# EAGLE board teensyMotors02_up_LED (EAGLE 9.1.3)
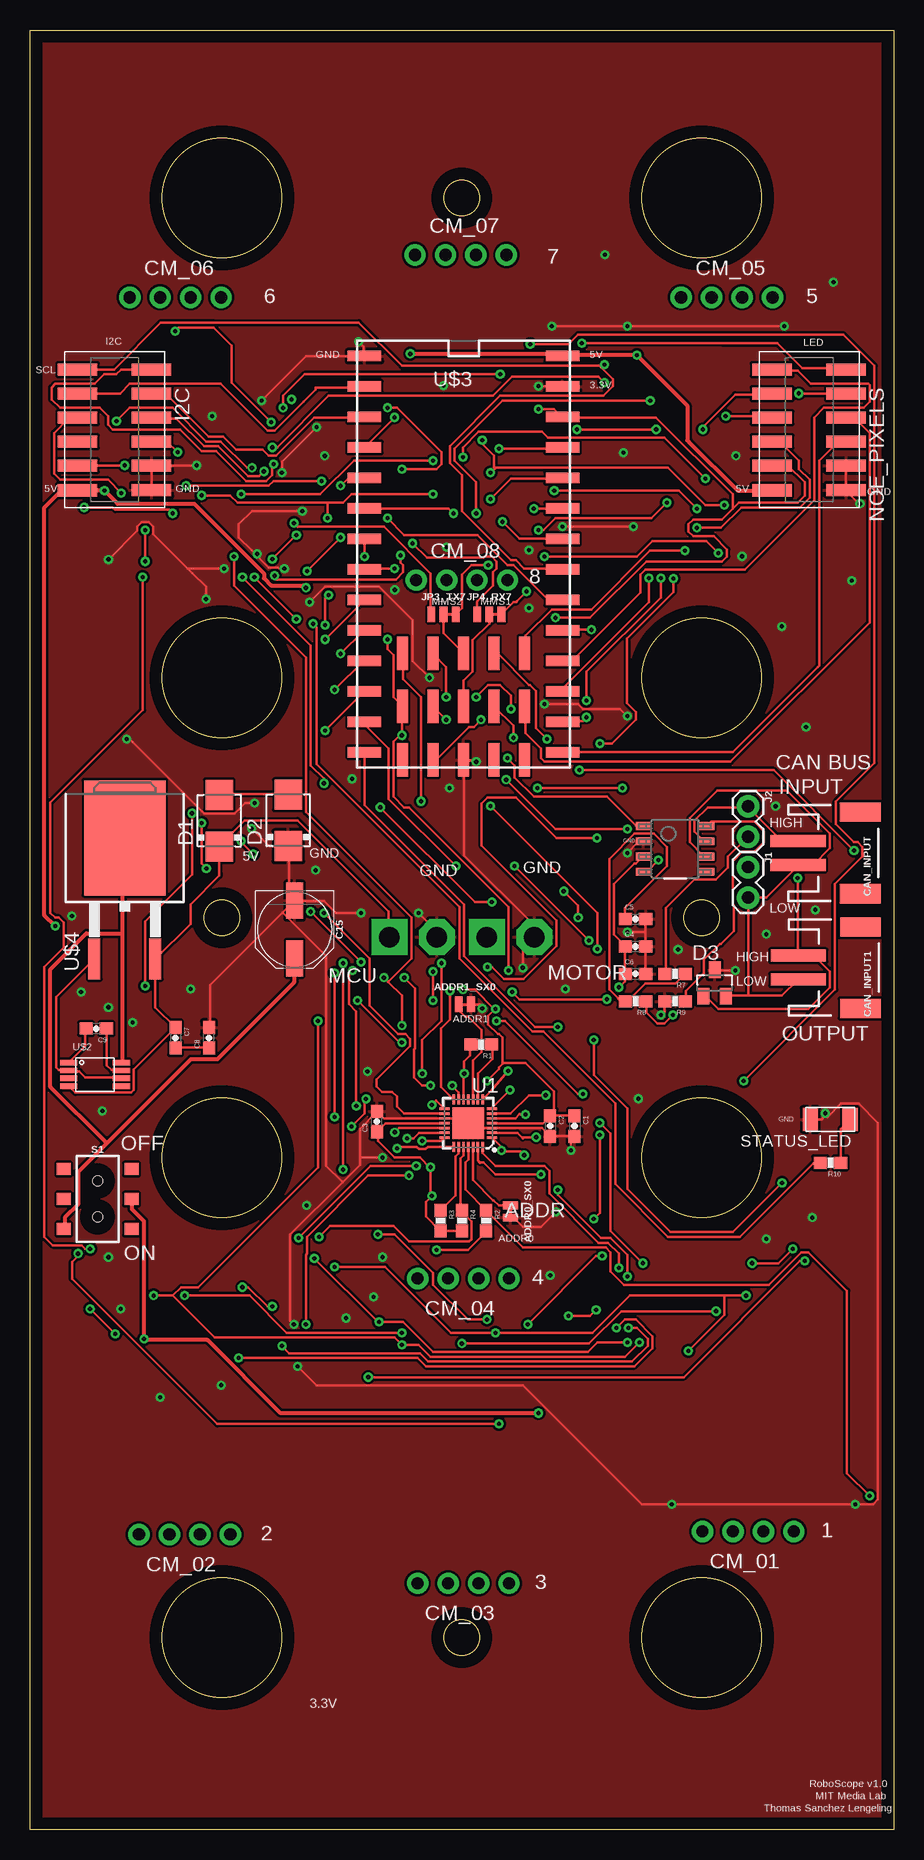
[diagram p2: board, top side]
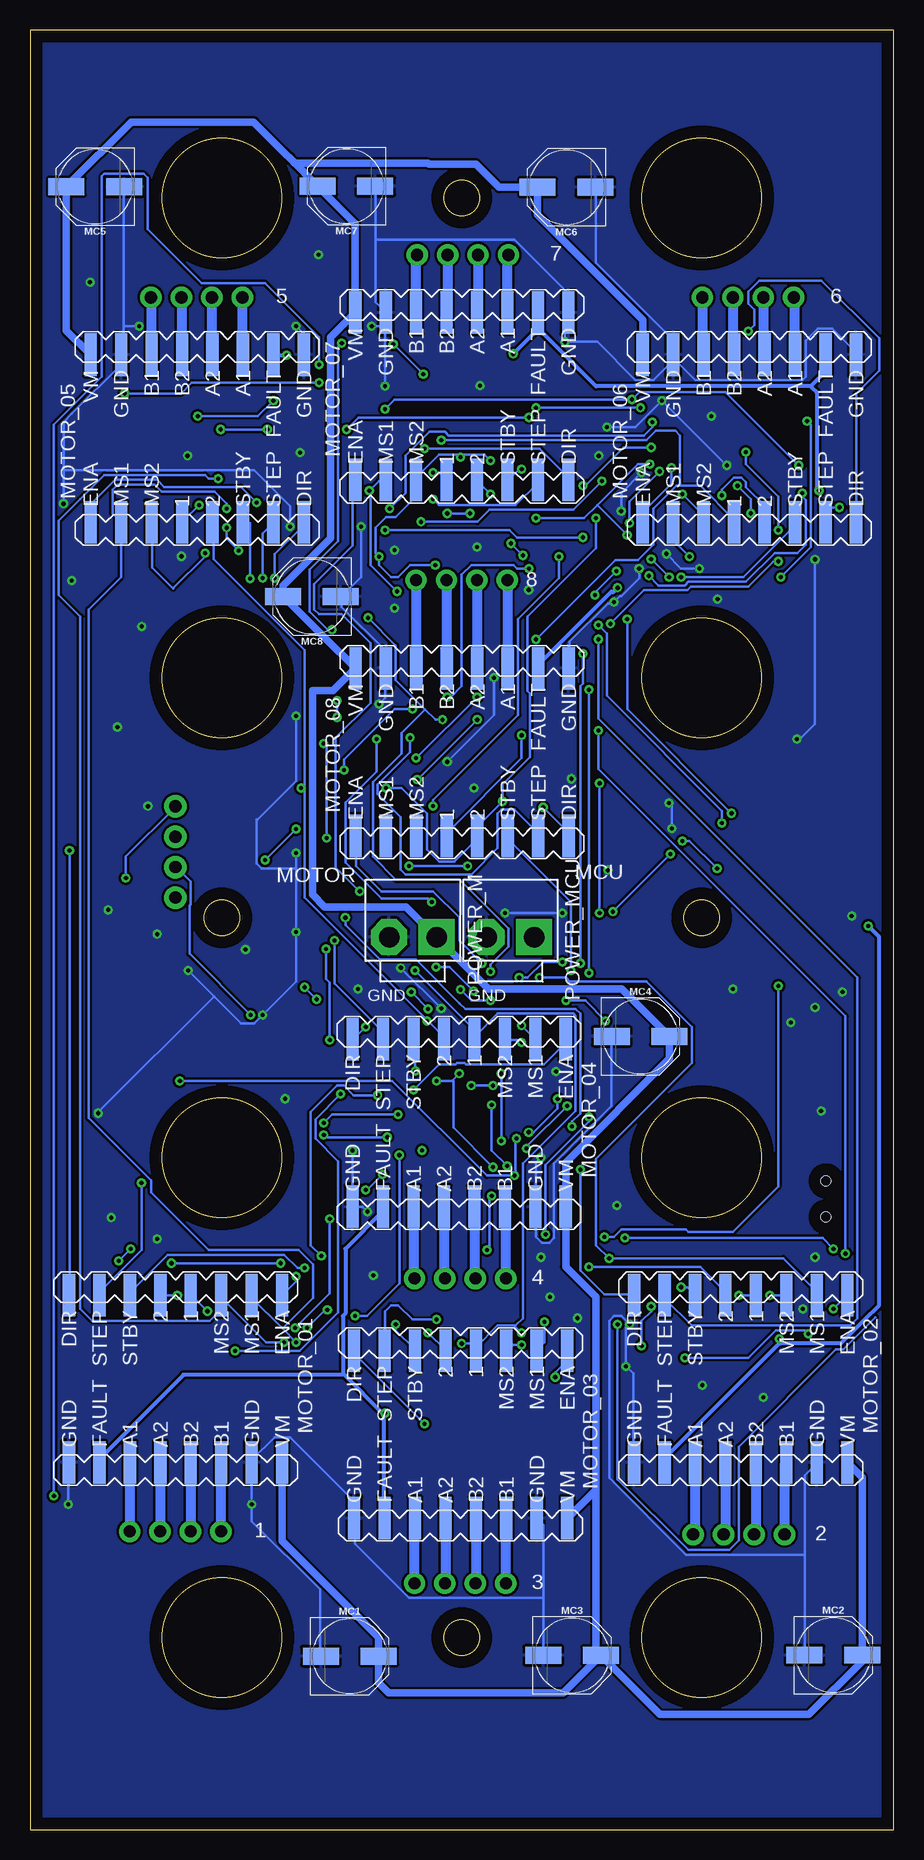
[diagram p3: board, bottom side, seen from below]

Size 72 x 150 mm. Coordinates in mm from the lower left corner, seen from the top.
Outline: 72,150 72,0 0,0 0,150 72,150
Outline: circle at 56,136 radius 5
Outline: circle at 56,96 radius 5
Outline: circle at 56,56 radius 5
Outline: circle at 56,16 radius 5
Outline: circle at 16,16 radius 5
Outline: circle at 16,56 radius 5
Outline: circle at 16,96 radius 5
Outline: circle at 16,136 radius 5
Outline: circle at 36,136 radius 1.5
Outline: circle at 16,76 radius 1.5
Outline: circle at 36,16 radius 1.5
Outline: circle at 56,76 radius 1.5
Copper layers (1*16): Top 0.035mm / dielectric 1.5mm / Bottom 0.035mm
Design rules "default *": minimum track width 6mil, minimum drill 0.35mm, track to track 6mil, track to pad 6mil, pad to pad 6mil, via to via 6mil, smd to smd 6mil, copper to edge 40mil, drill to drill 6mil, minimum pad ring 10mil, minimum via ring 8mil, stop-mask expansion 4mil, vias tented up to drill 0mil, thermal gap 10mil
Net classes: 0 default: width 0.2 mm, clearance 0.2 mm; 1 gnd: width 0.2 mm, clearance 0.2 mm; 3 vcc: width 0.2 mm, clearance 0.2 mm; 4 vcc5: width 0.35 mm, clearance 0.2 mm

## Footprints (pad centres in the part's own frame; a part is rotated, then mirrored left to right if it is on the bottom)
SMT-JUMPER_2_NC_TRACE_NO-SILK = smd 0.635 x 1.27: 1 -0.508,0; 2 0.508,0
0603-CAP = smd 1.1 x 1: 1 -0.85,0; 2 0.85,0
PANASONIC_D = smd 3 x 1.4: + 2.4,0; - -2.4,0
JST-2-SMD = smd 1 x 4.6: 1 -1,-3.7; 2 1,-3.7 | smd 1.6 x 3.4: NC1 -3.4,1.5; NC2 3.4,1.5
1X04-CLEANBIG = drill 1.016 pad 1.778: 1 -3.81,0; 2 -1.27,0; 3 1.27,0; 4 3.81,0
DO214AA = smd 2.5 x 2.3: A 2.15,0; C -2.15,0
SOT23 = smd 1 x 1.4: 1 -0.95,-1.1; 2 0.95,-1.1; 3 0,1.1
TMMH-105-12 = smd 1.016 x 3.302: 1 -5.27,-3.086; 2 -5.27,3.086; 3 -3.27,-3.086; 4 -3.27,3.086; 5 -1.27,-3.086; 6 -1.27,3.086; 7 0.73,-3.086; 8 0.73,3.086; 9 2.73,-3.086; 10 2.73,3.086; 11 4.781,-3.099; 12 4.755,3.086
1X02 = drill 1.016 pad 1.88: 1 0,0; 2 2.54,0
SMT-JUMPER_3_1-NC_TRACE_NO-SILK = smd 0.635 x 1.27: 1 -1.016,0; 2 0,0; 3 1.016,0
DRV8880 = smd 3.556 x 1.016: 1 -6.985,1.27; 2 -6.985,-1.27; A1 6.985,-3.81; A2 6.985,-1.27; B1 6.985,3.81; B2 6.985,1.27; DIR -6.985,-8.89; ENA -6.985,8.89; FAULT 6.985,-6.35; GND_0 6.985,-8.89; GND_1 6.985,6.35; MS1 -6.985,6.35; MS2 -6.985,3.81; STBY -6.985,-3.81; STEP -6.985,-6.35; VM 6.985,8.89
B2P-VH = drill 1.7 pad 3 square: 1 -1.98,0 | drill 1.7 pad 3 octagon: 2 1.98,0
0603-RES = smd 1.1 x 1: 1 -0.85,0; 2 0.85,0
SWITCH_DPDT_SMD_AYZ0202 = smd 1 x 1.15: 1 -2.5,2.825; 2 0,2.825; 3 2.5,2.825; 4 -2.5,-2.825; 5 0,-2.825; 6 2.5,-2.825 | hole 0.85: 1.5,0; -1.5,0
LED1206FAB = smd 1.27 x 1.905: 1 -1.651,0; 2 1.651,0
QFN-28 = smd 0.85 x 0.2: 1 -1.975,1.2; 2 -1.975,0.8; 3 -1.975,0.4; 4 -1.975,0; 5 -1.975,-0.4; 6 -1.975,-0.8; 7 -1.975,-1.2; 15 1.975,-1.2; 16 1.975,-0.8; 17 1.975,-0.4; 18 1.975,0; 19 1.975,0.4; 20 1.975,0.8; 21 1.975,1.2 | smd 0.2 x 0.85: 8 -1.2,-1.975; 9 -0.8,-1.975; 10 -0.4,-1.975; 11 0,-1.975; 12 0.4,-1.975; 13 0.8,-1.975; 14 1.2,-1.975; 22 1.2,1.975; 23 0.8,1.975; 24 0.4,1.975; 25 0,1.975; 26 -0.4,1.975; 27 -0.8,1.975; 28 -1.2,1.975 | smd 2.65 x 2.65: 29 0,0
SN65HVD232Q = smd 1.27 x 0.635: CANH 2.625,0.635; CANL 2.625,-0.635; D -2.625,1.905; GND -2.625,0.635; R -2.625,-1.905; RS 2.625,1.905; VCC -2.625,-0.635; VREF 2.625,-1.905
VSSOP(8) = smd 1.435 x 0.445: ANODE -2.2,-1.05; CATHODE 2.2,0.9; GDRIVE 2.2,-0.4; GPD -2.2,0.25; NC@1 -2.2,-0.4; NC@2 2.2,-1.05; VCAPH 2.2,0.25; VCAPL -2.2,0.9
TEENSY_4.0_SMD = smd 2.794 x 0.889: 0 -8.255,13.97; 1 -8.255,11.43; 2 -8.255,8.89; 3 -8.255,6.35; 3.3V 8.255,11.43; 4 -8.255,3.81; 5 -8.255,1.27; 6 -8.255,-1.27; 7 -8.255,-3.81; 8 -8.255,-6.35; 9 -8.255,-8.89; 10 -8.255,-11.43; 11 -8.255,-13.97; 12 -8.255,-16.51; 13 8.255,-16.51; 14/A0 8.255,-13.97; 15/A1 8.255,-11.43; 16/A2 8.255,-8.89; 17/A3 8.255,-6.35; 18/A4 8.255,-3.81; 19/A5 8.255,-1.27; 20/A6 8.255,1.27; 21/A7 8.255,3.81; 22/A8 8.255,6.35; 23/A9 8.255,8.89; GND -8.255,16.51; GND2 8.255,13.97; VIN 8.255,16.51 | smd 0.889 x 2.794: 3.3V1 -2.54,-17.145; 24 5.08,-12.7; 25 5.08,-8.255; 26 2.54,-12.7; 27 2.54,-8.255; 28 0,-12.7; 29 0,-8.255; 30 -2.54,-12.7; 31 -2.54,-8.255; 32 -5.08,-12.7; 33 -5.08,-8.255; GND1 0,-17.145; PGM 2.54,-17.145; RESET 5.08,-17.145; VBAT -5.08,-17.145
TO263-3 = smd 1 x 3.4: 1 -2.54,-9.14; 3 2.54,-9.14 | smd 6.8 x 9.6: 4 0,0.96
SX1509 = smd 2.184 x 1.067: 0 -7.62,7.62; 1 -7.62,5.08; 2 -7.62,2.54; 3 -7.62,0; 4 -7.62,-5.08; 5 -7.62,-7.62; 6 -7.62,-10.16; 7 -7.62,-12.7; 8 7.62,-12.7; 9 7.62,-10.16; 10 7.62,-7.62; 11 7.62,-5.08; 12 7.62,0; 13 7.62,2.54; 14 7.62,5.08; 15 7.62,7.62; GND_1 7.62,10.16; GND_2 -7.62,10.16; VC2 7.62,-2.54; VCC1 -7.62,-2.54 | smd 1.067 x 2.184: 3.3V 1.27,-17.78; 3.3V_1 1.27,15.24; GND -1.27,-17.78; GND_3 -1.27,15.24; INT -6.35,15.24; OSC -6.35,-17.78; RST -3.81,-17.78; RST_1 -3.81,15.24; SCL 6.35,-17.78; SCL_2 6.35,15.24; SDA 3.81,-17.78; SDA_2 3.81,15.24

## Placement (x,y rotation side)
ADDR0_SX0  JUMPER-SMT_2_NC_TRACE_NO-SILK  [SMT-JUMPER_2_NC_TRACE_NO-SILK]  40.07,51.52 270 top
ADDR1_SX0  JUMPER-SMT_2_NC_TRACE_NO-SILK  [SMT-JUMPER_2_NC_TRACE_NO-SILK]  36.26,68.79 0 top
C1  0.1uF  [0603-CAP]  45.4,58.63 270 top
C2  0.1uF  [0603-CAP]  43.37,58.63 270 top
C3  0.1uF  [0603-CAP]  28.93,59.01 90 top
C4  2.2uf  [0603-CAP]  50.48,73.61 0 top
C5  4.7uf  [0603-CAP]  50.48,75.9 0 top
C6  0.1uf  [0603-CAP]  50.48,71.33 0 top
C7  0.1uf  [0603-CAP]  12.13,65.99 270 top
C8  0.1uf  [0603-CAP]  14.92,65.99 90 top
C9  2.2uf  [0603-CAP]  5.53,66.76 180 top
C15  100uF  [PANASONIC_D]  22.07,75.02 270 top
CAN_INPUT  [JST-2-SMD]  67.73,81.4 270 top
CAN_INPUT1  [JST-2-SMD]  67.76,71.84 270 top
CM_01  1X04_STRAIGHT  [1X04-CLEANBIG]  59.88,24.85 180 top
CM_02  1X04_STRAIGHT  [1X04-CLEANBIG]  12.89,24.59 180 top
CM_03  1X04_STRAIGHT  [1X04-CLEANBIG]  36.13,20.53 180 top
CM_04  1X04_STRAIGHT  [1X04-CLEANBIG]  36.13,45.93 180 top
CM_05  1X04_STRAIGHT  [1X04-CLEANBIG]  58.1,127.72 0 top
CM_06  1X04_STRAIGHT  [1X04-CLEANBIG]  12.13,127.72 0 top
CM_07  1X04_STRAIGHT  [1X04-CLEANBIG]  35.91,131.24 0 top
CM_08  1X04_STRAIGHT  [1X04-CLEANBIG]  36.01,104.15 0 top
D1  S2M  [DO214AA]  15.78,84.09 90 top
D2  S2M  [DO214AA]  21.54,84.11 90 top
D3  PESD1CAN  [SOT23]  57.09,70.57 0 top
I2C  TMMH-105-12  [TMMH-105-12]  7.05,116.41 270 top
J1  [1X02]  59.88,80.22 270 top
J2  [1X02]  59.88,85.3 270 top
JP3_TX7  JUMPER-SMT_3_1-NC_TRACE_NO-SILK  [SMT-JUMPER_3_1-NC_TRACE_NO-SILK]  34.48,101.3 0 top
JP4_RX7  JUMPER-SMT_3_1-NC_TRACE_NO-SILK  [SMT-JUMPER_3_1-NC_TRACE_NO-SILK]  38.29,101.3 0 top
MC1  100uF  [PANASONIC_D]  45.34,14.45 0 bottom
MC2  100uF  [PANASONIC_D]  5.02,14.54 0 bottom
MC3  100uF  [PANASONIC_D]  26.8,14.51 0 bottom
MC4  100uF  [PANASONIC_D]  21.1,66.1 0 bottom
MC5  100uF  [PANASONIC_D]  66.56,136.94 180 bottom
MC6  100uF  [PANASONIC_D]  27.27,136.89 180 bottom
MC7  100uF  [PANASONIC_D]  45.61,136.98 180 bottom
MC8  100uF  [PANASONIC_D]  48.48,102.77 180 bottom
MOTOR_01  DRV8880  [DRV8880]  59.86,37.57 270 bottom
MOTOR_02  DRV8880  [DRV8880]  12.74,37.57 270 bottom
MOTOR_03  DRV8880  [DRV8880]  36.09,32.94 270 bottom
MOTOR_04  DRV8880  [DRV8880]  36.22,58.89 270 bottom
MOTOR_05  DRV8880  [DRV8880]  58.05,115.95 90 bottom
MOTOR_06  DRV8880  [DRV8880]  12.02,115.95 90 bottom
MOTOR_07  DRV8880  [DRV8880]  35.99,119.47 90 bottom
MOTOR_08  DRV8880  [DRV8880]  35.98,89.82 90 bottom
NOE_PIXELS  TMMH-105-12  [TMMH-105-12]  64.96,116.41 270 top
POWER_M  B2P-VH  [B2P-VH]  40.07,74.38 180 bottom
POWER_MCU  B2P-VH  [B2P-VH]  31.94,74.38 180 bottom
R1  10K  [0603-RES]  37.64,65.42 180 top
R2  10K  [0603-RES]  38.04,50.75 270 top
R3  10K  [0603-RES]  34.23,50.75 270 top
R4  10K  [0603-RES]  36.01,50.75 270 top
R7  60  [0603-RES]  53.79,71.33 180 top
R8  60  [0603-RES]  50.48,69.04 180 top
R9  10K  [0603-RES]  53.79,69.04 180 top
R10  500  [0603-RES]  66.74,55.58 180 top
S1  [SWITCH_DPDT_SMD_AYZ0202]  5.64,52.56 270 top
STATUS_LED  LEDFAB1206  [LED1206FAB]  66.72,59.19 180 top
U1  SX1509  [QFN-28]  36.55,58.87 180 top
U$1  SN65HVD232Q  [SN65HVD232Q]  53.79,81.74 0 top
U$2  [VSSOP(8)]  5.43,63.02 0 top
U$3  TEENSY_4.0_WITH_SMD_HEADER_PINSTEENSY_4.0_SMD  [TEENSY_4.0_SMD]  36.15,106.31 0 top
U$4  [TO263-3]  7.91,81.69 0 top
U$5  SX1509  [SX1509]  -18.86,12.15 0 top  (outside the outline)

## Tracks (layer width: path | path; a pad name or v marks a point on that pad's centre or on a via)
0_SX0  (via drill 0.35)
  Top 0.2: U1.27 37.35,55.76 37.53,55.58 37.61,55.61 37.81,55.61 38.81,54.61 v42.61,54.61 | v44.01,53.31 44.01,52.91 47.61,49.31 48.41,49.31 49.81,47.91 v49.81,46.11
  Bottom 0.2: v42.61,54.61 43.91,53.31 v44.01,53.31 | v49.81,46.11 49.81,45.71 50.91,44.61 MOTOR_01.ENA
1_SX0  (via drill 0.35)
  Top 0.2: U1.28 37.75,56.38 38.8,55.33 38.81,55.31 42.91,55.31 43.31,54.91 43.31,53.01 47.41,48.91 48.21,48.91 49.11,48.01 v49.11,46.81
  Bottom 0.2: v49.11,46.81 49.71,46.81 50.81,47.91 60.51,47.91 63.61,44.81 63.61,44.61 MOTOR_01.STBY
2_SX0  (via drill 0.35)
  Top 0.2: U1.1 39.31,56.89 v39.31,56.6 39.41,56.51 40.91,56.51 v41.21,56.21 | v44.91,42.81 46.71,42.81 v47.21,43.31 | v48.91,41.81 49.61,42.51 50.51,42.51 51.91,41.11 51.91,40.11 50.41,38.61 33.01,38.61 32.31,39.31 v17.41,39.31 | v5.01,43.41 v7.11,41.31
  Bottom 0.2: v41.21,56.21 41.21,45.51 43.91,42.81 v44.91,42.81 | v47.21,43.31 47.41,43.31 v48.91,41.81 | v17.41,39.31 12.11,39.31 9.81,41.61 7.41,41.61 v7.11,41.31 | v5.01,43.41 3.91,44.51 MOTOR_02.ENA
3.3V  (via drill 0.35)
  Top 0.2: R4.2 34.31,49.91 R3.2 34.21,49.91 33.01,51.11 33.01,52.31 v33.51,52.81 33.41,52.81 33.41,55.11 33.36,55.16 | v33.91,48.31 36.51,48.31 38.01,49.81 R2.2 | 33.36,55.16 32.51,56.01 30.41,56.01 29.01,57.41 29.01,58.11 C3.1 29.63,58.87 U1.18 | U$1.VCC 51.11,81.11 50.51,80.51 50.41,80.51 48.71,78.81 48.71,74.61 49.61,73.71 C4.1 49.61,73.61 49.61,71.41 C6.1 49.61,71.31 49.61,70.71 v49.11,70.21 | 43.71,59.51 45.31,59.51 C1.1 | 43.71,59.51 43.41,59.51 C2.1 | v38.11,62.41 39.11,63.41 39.11,63.51 39.46,63.86 | 39.46,63.86 39.51,63.91 41.31,63.91 43.71,61.51 43.71,59.51 | R1.2 36.71,65.41 36.71,64.51 36.21,64.01 v36.21,63.01 36.15,62.95 U1.12 | 43.71,59.51 C2.1 | v48.11,69.21 40.81,69.21 v40.21,69.81 | 39.46,63.86 39.41,63.91 39.41,66.01 39.11,66.31 39.01,66.31 38.21,67.11 38.21,67.81 v38.81,68.41 38.71,68.41 37.11,70.01 v36.11,70.01 | v33.41,55.21 33.36,55.16 | v37.61,92.51 37.01,91.91 36.61,91.91 33.91,89.21 33.61,89.21 U$3.3.3V1 | v43.81,101.01 46.71,101.01 51.41,105.71 57.71,105.71 58.11,106.11 58.11,106.71 57.01,107.81 55.31,107.81 54.91,108.21 54.91,108.81 55.31,109.21 57.71,109.21 58.61,110.11 | 58.61,110.11 58.61,111.31 52.21,117.71 44.41,117.71 U$3.3.3V 44.31,117.81 43.71,118.41 v42.41,118.41 | v33.61,71.51 v33.61,69.11 | U1.4 42.76,58.87 C2.1 | v7.91,113.71 4.01,113.71 I2C.9 | 58.61,110.11 59.11,110.61 64.01,110.61 64.61,111.21 64.61,112.31 63.21,113.71 61.91,113.71 NOE_PIXELS.9
  Bottom 0.2: v33.91,48.31 33.71,48.51 33.71,52.61 v33.51,52.81 | 36.76,62.46 36.81,62.41 v38.11,62.41 | 36.76,62.46 v36.21,63.01 | v48.11,69.21 v49.11,70.21 | v38.81,68.41 v40.21,69.81 | v33.41,55.21 36.71,58.51 36.71,62.41 36.76,62.46 | v37.61,92.51 38.21,92.51 39.06,93.36 | 39.06,93.36 41.51,95.81 41.51,98.71 v43.81,101.01 | v42.41,118.41 41.61,119.21 v21.81,119.21 21.21,119.81 14.01,119.81 v7.91,113.71 | v36.11,70.01 35.21,69.11 v33.61,69.11 | v33.61,71.51 33.61,72.11 32.11,73.61 32.11,75.11 36.21,79.21 41.51,79.21 43.41,81.11 43.41,87.31 41.01,89.71 41.01,91.41 39.11,93.31 39.06,93.36
3_SX0  (via drill 0.35)
  Top 0.2: U1.2 40.63,58.07 41.05,57.65 | 41.05,57.65 41.09,57.61 | v42.21,57.71 41.11,57.71 41.05,57.65 | v47.51,57.91 47.51,51.41 v47.01,50.91 | v49.91,41.81 50.61,41.81 51.51,40.91 51.51,40.31 50.21,39.01 33.21,39.01 32.51,39.71 21.61,39.71 v21.01,40.31 | v20.21,43.61 19.81,43.61 18.21,45.21 v17.71,45.21
  Bottom 0.2: v42.21,57.71 47.31,57.71 v47.51,57.91 | v47.01,50.91 47.01,44.71 v49.91,41.81 | v21.01,40.31 21.01,42.41 20.21,43.21 v20.21,43.61 | v17.71,45.21 17.21,45.21 16.61,44.61 MOTOR_02.STBY
4_SX0  (via drill 0.35)
  Top 0.2: U1.5 40.46,59.27 40.83,59.64 40.91,59.61 v41.31,59.61 | v47.51,58.91 48.41,58.01 48.41,49.91 v51.11,47.21 | v60.21,47.21 62.41,47.21 v63.61,48.41 | v64.61,47.41 64.21,47.41 54.51,37.71 v28.21,37.71
  Bottom 0.2: v41.31,59.61 46.81,59.61 v47.51,58.91 | v60.21,47.21 v51.11,47.21 | v64.61,47.41 v63.61,48.41 | v28.21,37.71 28.21,38.11 27.21,39.11 27.21,39.91 MOTOR_03.ENA
5_SX0  (via drill 0.35)
  Top 0.2: U1.6 40.07,59.67 41.59,61.17 41.61,61.21 v43.01,61.21 | v47.71,47.81 47.21,47.81 v41.51,42.11
  Bottom 0.2: v43.01,61.21 45.01,61.21 45.81,62.01 46.41,62.01 48.61,59.81 48.61,48.71 v47.71,47.81 | v41.51,42.11 41.51,41.61 39.91,40.01 MOTOR_03.STBY
6_SX0  (via drill 0.35)
  Top 0.2: v40.03,61.66 38.53,60.16 U1.7
  Bottom 0.2: v40.03,61.66 37.91,63.78 36.53,63.78 36.41,63.91 35.78,63.91 35.66,63.78 29.16,63.78 27.41,65.53 27.41,65.78 MOTOR_04.ENA
7_SX0  (via drill 0.35)
  Top 0.2: v39.87,63.22 38.42,61.56 U1.8
  Bottom 0.2: v39.87,63.22 39.91,63.28 39.91,65.78 MOTOR_04.STBY
8_SX0  (via drill 0.35)
  Top 0.2: U1.13 35.75,61.42 35.24,61.93 v35.21,62.01 | v33.41,62.01 32.71,62.01 32.01,62.71 32.01,65.01 32.11,65.11 32.11,70.11 v31.21,71.01 | v23.41,76.51 v27.61,72.31 | v18.61,81.31 17.61,82.31 v17.61,82.41 | v14.71,80.11 14.31,80.51 v14.31,83.91 | v24.61,100.41 24.61,102.61 v24.91,102.91 | v25.91,107.71 v23.11,104.91 | v42.41,108.31 42.81,108.31 43.81,109.31 51.81,109.31 v53.11,110.61
  Bottom 0.2: v33.41,62.01 v35.21,62.01 | v31.21,71.01 30.51,71.01 29.21,72.31 v27.61,72.31 | v18.61,81.31 v23.41,76.51 | v17.61,82.41 17.01,82.41 v14.71,80.11 | v24.61,100.41 23.91,99.71 23.91,94.51 14.31,84.91 v14.31,83.91 | v24.91,102.91 24.91,103.11 v23.11,104.91 | v25.91,107.71 31.41,107.71 32.01,108.31 v42.41,108.31 | v53.11,110.61 54.41,111.91 60.81,111.91 61.41,112.51 64.91,112.51 66.91,110.51 66.91,109.01 MOTOR_05.ENA
9_SX0  (via drill 0.35)
  Top 0.2: v35.03,69.91 35.03,67.53 34.28,66.78 34.28,61.91 35.28,60.91 U1.14 | v38.16,71.91 38.53,71.91 39.53,70.91 41.16,70.91 43.91,73.66 43.91,75.78 37.66,82.03 37.66,85.53 38.16,86.03 40.53,86.03 43.91,82.66 v47.28,82.66 | v47.53,90.53 48.53,90.53 50.53,92.53 50.53,93.16 49.78,93.91 49.78,99.28 53.66,103.16 v53.66,104.28
  Bottom 0.2: v35.03,69.91 37.03,71.91 v38.16,71.91 | v47.28,82.66 47.28,90.53 v47.53,90.53 | v53.66,104.28 53.66,108.91 54.16,108.91 MOTOR_05.STBY
10_SX0  (via drill 0.35)
  Top 0.2: U1.15 33.87,60.77 33.81,60.71 v33.51,60.41 | v32.21,55.31 28.41,55.31 v22.41,49.31 | v5.01,48.41 4.61,48.41 4.31,48.71 1.91,48.71 1.21,49.41 1.21,71.91 2.81,73.51 2.81,75.61 2.41,76.01 2.11,76.01 1.71,76.41 1.71,85.61 9.41,93.31 v9.41,104.41 | v18.51,113.51 18.11,113.51 15.91,115.71 14.71,115.71 11.91,118.51 8.31,118.51 v7.21,117.41
  Bottom 0.2: v33.51,60.41 33.51,56.61 v32.21,55.31 | v22.41,49.31 5.91,49.31 v5.01,48.41 | v18.51,113.51 18.51,112.21 20.91,109.81 20.91,109.01 MOTOR_06.ENA | v7.21,117.41 6.91,117.11 6.91,106.91 v9.41,104.41
11_SX0  (via drill 0.35)
  Top 0.2: U1.16 31.18,59.67 30.58,60.27 30.58,61.09 30.19,61.48 29.37,61.48 28.89,61.96 28.89,62.18 28.91,62.21 28.91,62.51 31.71,65.31 31.71,65.91 31.31,66.31 30.71,66.31 28.31,68.71 28.31,72.61 v24.51,76.41 | v24.51,87.21 24.51,87.61 23.41,88.71 23.41,98.71 v17.71,104.41
  Bottom 0.2: v24.51,87.21 v24.51,76.41 | v17.71,104.41 12.51,104.41 8.31,108.61 8.31,108.91 MOTOR_06.STBY
12_SX0  (via drill 0.35)
  Top 0.2: U1.19 30.77,58.47 v30.42,58.12 | v26.81,58.61 27.91,59.71 27.91,60.81 v28.01,60.91 | v45.71,76.01 45.71,77.01 v44.51,78.21
  Bottom 0.2: v26.81,58.61 26.81,59.01 26.11,59.71 26.11,68.01 26.51,68.41 35.71,68.41 36.17,68.87 39.81,72.51 42.81,72.51 45.71,75.41 v45.71,76.01 | v44.51,78.21 46.51,80.21 46.51,91.01 43.61,93.91 43.61,98.91 46.01,101.31 47.91,101.31 48.31,101.71 48.31,103.81 45.11,107.01 45.11,112.21 44.91,112.41 MOTOR_07.ENA | v28.01,60.91 28.01,60.11 30.01,58.11 v30.41,58.11 v30.42,58.12
13_SX0  (via drill 0.35)
  Top 0.2: v31.43,57.61 31.97,57.61 32.42,58.07 U1.20 | v31.61,54.51 28.21,54.51 23.11,49.41 23.11,48.01 23.01,47.91 v23.01,42.11 | v29.81,118.51 30.61,118.51 34.31,114.81 34.31,113.81 33.91,113.41 v31.01,113.41 | v21.11,118.51 21.11,119.51 22.91,121.31 v39.21,121.31 | v41.71,123.81 44.91,123.81 45.71,124.61 67.81,124.61 70.41,122.01 70.41,88.91 67.21,85.71 67.21,83.81 68.71,82.31 69.01,82.31 69.41,81.91 69.41,81.11 67.11,78.81 67.11,70.01 v59.51,62.41
  Bottom 0.2: v23.01,42.11 23.01,29.21 17.11,23.31 13.71,23.31 12.91,24.11 12.91,31.91 4.81,40.01 4.21,40.01 1.51,42.71 | v31.01,113.41 31.21,113.41 32.11,112.51 MOTOR_07.STBY | v31.43,57.61 31.51,57.61 31.51,54.61 v31.61,54.51 33.91,54.51 41.81,62.41 v59.51,62.41 | v21.11,118.51 v29.81,118.51 | v41.71,123.81 v39.21,121.31
14_SX0  (via drill 0.35)
  Top 0.2: U1.21 34.3,57.39 v32.7,57.39 | v32.71,63.01 32.71,65.81 34.31,67.41 v34.31,72.21
  Bottom 0.2: v32.71,63.01 v32.71,57.41 v32.7,57.39 | v34.31,72.21 36.21,74.11 36.21,76.01 38.41,78.21 42.71,78.21 44.81,80.31 44.81,82.81 MOTOR_08.ENA
15_SX0  (via drill 0.35)
  Top 0.2: v30.6,56.77 30.72,56.89 32.24,56.89 32.42,56.71 32.99,56.71 33.17,56.89 U1.22 | v27.21,60.31 27.21,68.21 26.61,68.81 26.61,71.31 v26.91,71.61
  Bottom 0.2: v27.21,60.31 30.51,57.01 30.51,56.81 v30.6,56.77 | v26.91,71.61 26.91,77.31 32.11,82.51 32.11,82.81 MOTOR_08.STBY
28_MMS1
  Top 0.2: JP4_RX7.2 38.29,100.54 36.89,99.14 36.89,96.54 36.15,95.79 U$3.28
29_MMS2
  Top 0.2: JP3_TX7.2 34.48,99.72 U$3.29
!INT_SX0
  Top 0.2: U1.9 37.35,63.02 38.55,64.22 38.55,65.36 R1.1
!RESET_SX0
  Top 0.2: U1.23 35.75,56.35 35.5,56.09 35.5,52.87 R3.1
ADDR0_SX0
  Top 0.2: U1.26 36.95,54.13 38.62,52.45 38.66,52.45 39.09,52.02 39.31,52.02 | 39.31,52.02 39.64,52.02 | ADDR0_SX0.1 39.31,52.02
ADDR1_SX0
  Top 0.2: U1.10 36.95,64.11 37.64,64.8 37.64,66.65 36.51,67.77 36.26,67.77 35.88,68.15 | 35.88,68.15 35.75,68.28 | ADDR1_SX0.1 35.75,68.28 | 35.75,68.28 35.88,68.15
CAN_H  (via drill 0.35)
  Top 0.2: D3.1 56.21,69.41 56.41,69.41 57.41,68.41 64.91,68.41 66.71,70.21 66.71,71.51 65.41,72.81 64.11,72.81 CAN_INPUT1.1 64.01,72.91 v64.01,79.31 | U$1.CANH 56.41,82.41 56.21,82.41 55.41,83.21 55.41,84.11 56.51,85.21 59.81,85.21 J2.1 59.91,85.21 62.71,82.41 64.01,82.41 CAN_INPUT.1
  Bottom 0.2: v64.01,79.31 64.01,81.11 59.91,85.21 J2.1
CAN_L
  Top 0.2: 59.91,69.51 62.71,69.51 64.01,70.81 CAN_INPUT1.2 | 59.91,69.51 58.11,69.51 D3.2 | U$1.CANL 56.41,81.21 56.11,81.21 55.01,82.31 55.01,84.31 57.31,86.61 63.11,86.61 66.71,83.01 66.71,81.81 65.31,80.41 64.11,80.41 CAN_INPUT.2 64.01,80.31 61.41,77.71 59.91,77.71 J1.2 59.91,77.61 59.91,69.51
CAN_RX2
  Top 0.2: U$3.0 27.81,120.21 23.81,120.21 23.81,120.01 22.81,119.01 20.41,116.61 19.81,116.61 15.91,120.51 8.31,120.51 7.51,119.71 4.01,119.71 I2C.3
CAN_RX3  (via drill 0.35)
  Top 0.2: v52.41,80.81 51.51,79.91 51.21,79.91 U$1.R | v49.81,83.41 43.81,83.41 v39.71,87.51 | v34.71,92.51 U$3.30
  Bottom 0.2: v49.81,83.41 v52.41,80.81 | v34.71,92.51 v39.71,87.51
CAN_TX2
  Top 0.2: U$3.1 27.81,117.71 23.71,117.71 20.51,114.51 19.91,114.51 19.41,115.01 17.21,115.01 16.11,116.11 14.91,116.11 11.41,119.61 10.21,119.61 I2C.4 10.21,119.78
CAN_TX3  (via drill 0.35)
  Top 0.2: v39.81,89.31 40.41,88.71 40.41,87.71 42.01,86.11 48.11,86.11 50.51,83.71 51.11,83.71 U$1.D | v34.71,94.41 34.71,96.91 33.61,98.01 U$3.31
  Bottom 0.2: v34.71,94.41 v39.81,89.31
GND_MCU  (via drill 0.35)
  Top 0.2: v49.81,81.41 50.71,82.31 51.11,82.31 U$1.GND | v58.81,71.61 57.11,71.61 D3.3 | v22.31,38.61 23.91,37.01 41.11,37.01 51.01,27.11 v53.51,27.11 v68.81,27.11 70.31,27.11 70.71,27.51 70.71,58.91 69.11,60.51 67.61,60.51 66.51,59.41 66.31,59.41 66.21,59.51 66.21,59.61 v66.31,59.71 66.21,59.41 66.01,59.21 65.11,59.21 STATUS_LED.2 | 68.06,111.68 NOE_PIXELS.12 | 68.06,113.68 NOE_PIXELS.10 68.01,113.61 68.01,111.71 NOE_PIXELS.12 | 68.06,111.58 NOE_PIXELS.12 | v42.41,120.31 44.31,120.31 U$3.GND2 | v43.51,125.31 v49.81,125.31 v62.91,125.31 | v27.41,124.01 27.81,123.61 27.81,122.91 U$3.GND 27.81,122.81 23.01,122.81 v19.31,119.11 | 42.01,74.41 42.01,75.41 36.21,81.21 36.21,89.11 U$3.GND1 36.31,89.11 37.11,89.11 v37.21,89.01 | 42.01,74.41 POWER_M.2 | 10.21,111.58 I2C.12 10.11,111.68 10.14,111.71 I2C.10 | 10.11,113.68 I2C.10 | v33.31,96.01 31.91,97.41 31.91,100.81 29.11,103.61 24.61,103.61 v23.31,102.31 | C6.2 51.31,71.41 51.31,73.61 C4.2 51.31,73.71 51.31,74.81 | 51.31,74.81 51.31,75.81 C5.2 | v52.61,67.91 52.91,68.21 52.91,69.01 R9.2 | v49.81,74.81 51.31,74.81 | v42.91,93.81 45.71,93.81 46.11,93.41 49.21,93.41 v49.81,92.81 | 21.06,76.46 22.01,77.41 C15.- | 21.06,76.46 15.01,70.41 15.01,66.91 C8.2 | D2.C 21.61,81.91 21.61,77.91 22.01,77.51 C15.- | v32.41,76.41 33.91,74.91 33.91,74.41 POWER_MCU.2 | v27.61,76.41 25.51,76.41 24.51,77.41 22.11,77.41 C15.- | 45.11,57.81 43.41,57.81 C2.2 42.68,58.47 U1.3 36.95,58.47 U1.29 36.15,59.27 U1.17 29.52,59.27 C3.2 28.91,59.81 27.51,58.41 27.51,56.01 | 45.11,57.81 45.31,57.81 C1.2 45.11,57.81 | 27.51,56.01 27.51,55.41 26.06,53.96 | 26.06,53.96 21.71,49.61 21.71,42.41 v22.01,42.11
  Top 0.2: 45.11,57.81 v45.11,56.61 | 27.51,56.01 v29.41,56.01 | 21.06,76.46 21.11,76.41 24.71,72.81 24.71,55.31 26.01,54.01 26.06,53.96 | 21.51,82.01 D2.C | ADDR0_SX0.2 40.32,51.01 41.09,50.25 42.61,50.25 v43.86,51.49 | ADDR1_SX0.2 37.28,68.79 | 37.28,68.79 37.53,68.79 | 37.28,68.79 37.37,68.79 v37.71,68.45 | v41.09,71.83 41.09,73.49 42.01,74.41 | v69.21,110.51 69.11,110.51 68.11,111.51 NOE_PIXELS.12 | v13.91,113.71 10.21,113.71 I2C.10 | v21.21,105.11 20.81,105.11 20.71,105.21 19.91,105.21 18.48,106.63 17.41,107.71 17.41,108.81 18.51,109.91 v22.71,109.91 | v21.01,113.11 21.01,114.01 v23.91,116.91 | v44.41,108.61 v50.31,108.61 | D2.C 19.94,81.96 v18.48,83.43 | v18.73,85.55 17.92,85.55 17.06,84.69 14.51,84.69 14.33,84.86 14.33,84.87 8.57,90.63 8.32,90.89 v8.07,90.89 | v6.54,105.87 8.93,108.26 8.93,108.59 9.33,108.98 9.89,108.98 10.28,108.59 10.28,107.97 13.15,105.11 | v14.67,102.57 14.67,103.59 13.53,104.73 13.15,105.11 | 13.15,105.11 v16.19,105.11
  Bottom 0.2: 64.21,125.31 64.21,123.11 64.31,123.01 MOTOR_05.GND_1 64.41,122.91 64.41,122.11 68.51,118.01 69.21,117.31 69.21,113.31 | 64.21,125.31 64.21,136.91 MC5.- | 42.41,125.31 42.41,126.41 MOTOR_07.GND_1 | 42.41,125.31 v42.41,120.31 | 43.21,132.51 43.21,127.31 42.41,126.51 MOTOR_07.GND_1 | 43.21,132.51 43.21,136.91 MC7.- | v49.81,125.31 49.21,124.71 49.21,123.01 MOTOR_05.GND_0 | 42.41,125.31 v43.51,125.31 | 42.41,125.31 MOTOR_07.GND_1 | MC6.- 24.81,136.81 24.81,130.61 18.41,124.21 18.41,123.01 MOTOR_06.GND_1 | MOTOR_06.GND_0 3.21,123.01 3.21,123.21 5.11,125.11 6.31,125.11 7.31,124.11 7.31,121.11 7.61,120.81 16.51,120.81 18.31,122.61 18.31,122.91 MOTOR_06.GND_1 | MOTOR_06.GND_1 18.31,122.51 20.01,120.81 21.51,120.81 24.71,124.01 v27.41,124.01 27.41,126.11 27.11,126.41 MOTOR_07.GND_0 27.11,126.51 27.11,128.01 31.61,132.51 43.21,132.51 | v62.91,125.31 64.21,125.31 | MOTOR_08.GND_0 27.01,96.81 27.01,99.01 23.81,102.21 23.31,102.21 v23.31,102.31 22.81,102.81 22.71,102.81 21.21,104.31 v21.21,105.11 | v37.21,89.01 33.31,92.91 v33.31,96.01 | v58.81,71.61 56.66,69.46 | 56.66,69.46 54.41,67.21 53.31,67.21 v52.61,67.91 49.81,70.71 v49.81,74.81 49.81,80.11 | 49.81,80.11 v49.81,81.41 | v42.91,93.81 42.41,94.31 42.41,96.71 MOTOR_08.GND_1 42.41,96.81 42.41,98.31 46.01,101.91 46.01,102.71 MC8.- 46.01,102.81 44.41,104.41 v44.41,108.61 | v49.81,92.81 49.81,87.41 53.06,84.16 | 53.06,84.16 53.11,84.11 53.11,80.51 52.71,80.11 49.81,80.11 | 29.21,19.31 29.21,25.41 29.71,25.91 MOTOR_03.GND_1 | 29.21,19.31 29.21,14.61 MC3.- | MC1.- 47.81,14.51 47.81,20.01 53.51,25.71 v53.51,27.11 53.51,30.51 MOTOR_01.GND_1 53.51,30.61 53.51,30.81 51.61,32.71 50.31,32.71 45.01,27.41 45.01,26.01 MOTOR_03.GND_0 44.91,25.91 44.91,23.81 40.41,19.31 29.21,19.31
  Bottom 0.2: v27.61,76.41 v32.41,76.41 | 29.81,51.91 29.81,49.41 29.31,48.91 28.71,48.91 28.31,49.31 28.31,55.51 23.51,60.31 23.51,66.01 MC4.- | 29.81,51.91 MOTOR_04.GND_1 29.81,51.91 | 7.41,22.91 7.41,29.51 6.41,30.51 MOTOR_02.GND_1 | 7.41,22.91 7.41,14.61 MC2.- | MOTOR_02.GND_0 21.71,30.61 21.71,38.01 v22.31,38.61 22.31,41.81 v22.01,42.11 22.71,42.81 23.31,42.81 23.71,42.41 23.71,29.31 17.31,22.91 7.41,22.91 | v45.11,56.61 MOTOR_04.GND_0 | MOTOR_04.GND_0 | v68.81,27.11 68.81,30.51 MOTOR_01.GND_0 | 29.81,51.91 29.81,55.61 v29.41,56.01 | v66.31,59.71 66.31,59.81 56.71,69.41 56.66,69.46 | 53.11,84.21 53.06,84.16 | v43.86,51.49 44.27,51.91 MOTOR_04.GND_0 | v37.71,68.45 v41.09,71.83 | 69.21,113.31 v69.21,110.51 | v13.91,113.71 v19.31,119.11 21.51,116.91 v23.91,116.91 | v22.71,109.91 22.71,111.41 v21.01,113.11 | 69.21,113.31 53.31,113.31 50.31,110.31 v50.31,108.61 | v18.48,83.43 18.48,85.3 v18.73,85.55 | v8.07,90.89 7.81,90.89 6.54,92.16 v6.54,105.87 | v16.19,105.11 17.72,105.11 v18.94,106.33
  other vias: 50.74,60.91 47.94,131.27 13.4,70.06 62.68,100.28 64.71,91.9 43.37,46.18 65.22,51.01 10.86,36.02 66.99,128.99 6.54,47.71 15.94,37.04 3.49,76.15 44.64,70.06 61.41,74.63 54.04,73.36 26.86,87.58 23.05,52.02 61.41,49.23 68.52,104.09 34.48,120.35 49.47,114.76 58.87,114.51 4.26,69.8 6.54,68.53 6.03,59.9 28.64,44.4 41.59,101.81 8.57,67.26 15.18,117.81 23.81,79.96 41.59,106.63 34.99,86.82 7.56,43.39 26.35,42.63 59.37,106.13 34.74,106.89 28.13,63.2 30.42,103.33 29.4,47.71 62.17,85.3 24.58,114.51 65.47,76.66
  pour Top: -3.11,154.13 75.63,154.13 75.63,-7.16 -3.11,-7.16
  pour Bottom: -4.13,154.13 78.42,154.13 78.42,-6.9 -4.13,-6.9
MA1_01
  Bottom 0.508: 63.67,24.87 CM_01.1
  Bottom 0.813: MOTOR_01.A1 63.67,24.87
MA1_02
  Bottom 0.508: 16.55,24.75 CM_02.1
  Bottom 0.813: MOTOR_02.A1 16.55,24.75
MA1_03
  Bottom 0.508: 39.94,25.92 MOTOR_03.A1
  Bottom 0.813: CM_03.1 39.94,25.92
MA1_04
  Bottom 0.508: 40.03,46.01 CM_04.1
  Bottom 0.813: MOTOR_04.A1 40.03,46.01
MA1_05
  Bottom 0.508: 54.29,122.99 MOTOR_05.A1
  Bottom 0.813: CM_05.1 54.29,122.99
MA1_06
  Bottom 0.508: 8.21,127.61 CM_06.1
  Bottom 0.813: MOTOR_06.A1 8.21,127.61
MA1_07
  Bottom 0.508: 32.18,131.16 CM_07.1
  Bottom 0.813: MOTOR_07.A1 32.18,131.16
MA1_08
  Bottom 0.508: 32.2,96.83 MOTOR_08.A1
  Bottom 0.813: CM_08.1 32.2,96.83
MA2_01
  Bottom 0.508: 61.13,24.87 CM_01.2
  Bottom 0.813: MOTOR_01.A2 61.13,24.87
MA2_02
  Bottom 0.508: 14.01,24.75 CM_02.2
  Bottom 0.813: MOTOR_02.A2 14.01,24.75
MA2_03
  Bottom 0.508: 37.36,20.57 CM_03.2
  Bottom 0.813: MOTOR_03.A2 37.36,20.57
MA2_04
  Bottom 0.508: 37.49,46.01 CM_04.2
  Bottom 0.813: MOTOR_04.A2 37.49,46.01
MA2_05
  Bottom 0.508: 56.83,122.99 MOTOR_05.A2
  Bottom 0.813: CM_05.2 56.83,122.99
MA2_06
  Bottom 0.508: 10.86,123.05 MOTOR_06.A2
  Bottom 0.813: CM_06.2 10.86,123.05
MA2_07
  Bottom 0.508: 34.64,126.54 MOTOR_07.A2
  Bottom 0.813: CM_07.2 34.64,126.54
MA2_08
  Bottom 0.508: 34.74,96.83 MOTOR_08.A2
  Bottom 0.813: CM_08.2 34.74,96.83
MB1_01
  Bottom 0.508: 56.07,30.56 MOTOR_01.B1
  Bottom 0.813: CM_01.4 56.07,30.56
MB1_02
  Bottom 0.508: 9.08,30.43 MOTOR_02.B1
  Bottom 0.813: CM_02.4 9.08,30.43
MB1_03
  Bottom 0.508: 32.32,25.92 MOTOR_03.B1
  Bottom 0.813: CM_03.4 32.32,25.92
MB1_04
  Bottom 0.508: 32.32,51.82 MOTOR_04.B1
  Bottom 0.813: CM_04.4 32.32,51.82
MB1_05
  Bottom 0.508: 61.91,122.99 MOTOR_05.B1
  Bottom 0.813: CM_05.4 61.91,122.99
MB1_06
  Bottom 0.508: 15.94,123.05 MOTOR_06.B1
  Bottom 0.813: CM_06.4 15.94,123.05
MB1_07
  Bottom 0.508: 39.8,131.16 CM_07.4
  Bottom 0.813: MOTOR_07.B1 39.8,131.16
MB1_08
  Bottom 0.508: 39.82,96.83 MOTOR_08.B1
  Bottom 0.813: CM_08.4 39.82,96.83
MB2_01
  Bottom 0.508: 58.59,24.87 CM_01.3
  Bottom 0.813: MOTOR_01.B2 58.59,24.87
MB2_02
  Bottom 0.508: 11.47,24.75 CM_02.3
  Bottom 0.813: MOTOR_02.B2 11.47,24.75
MB2_03
  Bottom 0.508: 34.82,20.57 CM_03.3
  Bottom 0.813: MOTOR_03.B2 34.82,20.57
MB2_04
  Bottom 0.508: 34.95,46.01 CM_04.3
  Bottom 0.813: MOTOR_04.B2 34.95,46.01
MB2_05
  Bottom 0.508: 59.37,122.99 MOTOR_05.B2
  Bottom 0.813: CM_05.3 59.37,122.99
MB2_06
  Bottom 0.508: 13.4,123.05 MOTOR_06.B2
  Bottom 0.813: CM_06.3 13.4,123.05
MB2_07
  Bottom 0.508: 37.18,126.54 MOTOR_07.B2
  Bottom 0.813: CM_07.3 37.18,126.54
MB2_08
  Bottom 0.508: 37.28,96.83 MOTOR_08.B2
  Bottom 0.813: CM_08.3 37.28,96.83
MDIR_01  (via drill 0.35)
  Top 0.2: v30.41,105.11 27.91,105.11 U$3.6 | v37.21,94.41 38.21,95.41 39.21,95.41 40.11,94.51 v40.11,93.41 | v45.81,88.31 62.01,88.31 v68.71,81.61
  Bottom 0.2: v30.41,105.11 31.41,105.11 31.71,105.41 35.21,105.41 36.01,104.61 36.01,95.31 36.91,94.41 v37.21,94.41 | v40.11,93.41 41.61,93.41 45.81,89.21 v45.81,88.31 | v68.71,81.61 68.71,44.61 MOTOR_01.DIR
MDIR_02  (via drill 0.35)
  Top 0.2: v25.91,98.01 27.81,99.91 U$3.8 | v26.11,55.01 v26.11,72.21
  Bottom 0.2: v25.91,98.01 25.91,95.51 26.11,95.31 v26.11,72.21 | v26.11,55.01 26.11,46.61 24.11,44.61 21.71,44.61 MOTOR_02.DIR
MDIR_03  (via drill 0.35)
  Top 0.2: v24.61,91.61 27.81,94.81 U$3.10 | v4.01,48.01 4.01,47.81 3.51,47.31 3.51,45.91 15.61,33.81 v39.11,33.81
  Bottom 0.2: v24.61,91.61 24.61,88.41 4.01,67.81 v4.01,48.01 | v39.11,33.81 44.91,39.61 44.91,39.91 MOTOR_03.DIR
MDIR_04  (via drill 0.35)
  Top 0.2: v44.01,66.91 42.11,66.91 36.21,72.81 36.21,77.11 27.91,85.41 27.91,89.71 U$3.12
  Bottom 0.2: v44.01,66.91 45.01,65.91 MOTOR_04.DIR
MDIR_05  (via drill 0.35)
  Top 0.2: v51.61,104.31 51.61,102.31 44.41,95.11 44.41,94.91 U$3.15/A1
  Bottom 0.2: v51.61,104.31 51.61,106.31 49.21,108.71 49.21,108.91 MOTOR_05.DIR
MDIR_06  (via drill 0.35)
  Top 0.2: v42.01,110.11 44.31,110.11 U$3.21/A7 | v12.11,124.91 12.41,125.21 15.31,125.21 16.81,123.71 16.81,120.61 v20.11,117.31
  Bottom 0.2: v42.01,110.11 40.71,111.41 40.71,114.51 38.71,116.51 37.41,116.51 37.11,116.21 20.81,116.21 20.11,116.91 v20.11,117.31 | 3.21,109.31 3.21,109.01 MOTOR_06.DIR 3.11,109.01 3.11,119.71 1.21,121.61 1.21,124.31 6.01,129.11 11.21,129.11 12.11,128.21 12.11,127.21 11.61,126.71 11.61,125.41 v12.11,124.91
MDIR_07  (via drill 0.35)
  Top 0.2: v39.11,115.11 44.31,115.11 U$3.23/A9
  Bottom 0.2: v39.11,115.11 29.51,115.11 27.11,112.71 27.11,112.51 MOTOR_07.DIR
MDIR_08  (via drill 0.35)
  Top 0.2: v43.11,90.91 42.21,91.81 42.21,94.91 41.71,95.41 41.61,95.41 39.01,98.01 38.71,98.01 U$3.27 | v38.51,77.31 37.11,77.31 v29.21,85.21
  Bottom 0.2: v43.11,90.91 43.11,88.21 45.71,85.61 45.71,80.61 42.71,77.61 38.81,77.61 v38.51,77.31 | v29.21,85.21 27.11,83.11 27.11,82.91 MOTOR_08.DIR
MMS1  (via drill 0.35)
  Top 0.2: v43.71,111.61 54.11,111.61 v55.61,110.11 | v23.71,47.61 29.01,42.31 v29.11,42.31 31.11,42.31 33.61,39.81 46.51,39.81 47.31,40.61 v49.81,40.61 | v31.01,67.01 31.01,69.51 29.86,70.66 | v29.51,71.01 29.86,70.66 | v17.01,106.11 17.01,103.71 23.01,97.71 23.01,84.81 31.81,76.01 31.81,72.61 29.91,70.71 29.86,70.66 | JP4_RX7.3 40.32,102.32 40.58,102.32 40.61,102.41 v41.41,103.21
  Bottom 0.2: v55.61,110.11 55.61,110.51 56.61,111.51 61.01,111.51 61.61,112.11 64.71,112.11 65.11,111.71 65.11,109.71 64.41,109.01 MOTOR_05.MS1 64.41,108.91 64.41,104.41 67.11,101.71 67.11,59.31 61.91,54.11 61.91,53.11 57.11,48.31 49.61,48.31 48.41,47.11 48.41,44.31 50.91,41.81 50.96,41.76 | MOTOR_07.MS1 42.41,112.41 42.91,112.41 v43.71,111.61 43.61,111.61 43.61,105.41 v41.41,103.21 | v29.11,42.31 29.11,40.61 29.71,40.01 MOTOR_03.MS1 | MOTOR_02.MS1 6.41,44.61 6.41,44.81 9.21,47.61 v23.71,47.61 24.81,48.71 24.81,55.91 16.81,63.91 16.81,66.91 20.61,70.71 27.01,70.71 27.31,71.01 v29.51,71.01 | v49.81,40.61 50.96,41.76 | 50.96,41.76 53.51,44.31 53.51,44.51 MOTOR_01.MS1 | v31.01,67.01 29.91,65.91 MOTOR_04.MS1 | v17.01,106.11 18.31,107.41 18.31,108.91 MOTOR_06.MS1
MMS2  (via drill 0.35)
  Top 0.2: v17.61,111.31 24.21,111.31 27.01,114.11 v33.61,114.11 | 11.91,44.51 v10.31,44.51 | 11.91,44.51 15.41,41.01 30.41,41.01 v31.01,40.41 32.41,40.41 33.41,39.41 49.61,39.41 v50.81,40.61 | v31.01,65.61 30.81,65.61 v27.31,69.11 | v24.01,67.41 24.01,55.21 14.01,45.21 12.61,45.21 11.91,44.51 | v36.11,114.41 36.11,115.21 37.41,116.51 42.71,116.51 43.21,116.01 52.91,116.01 v56.31,112.61 | JP3_TX7.3 36.01,101.81 36.01,102.06 36.01,102.11 36.01,104.61 36.81,105.41 v38.21,105.41 | v42.91,106.11 50.61,106.11 51.91,107.41 56.41,107.41 v57.41,106.41
  Bottom 0.2: v17.61,111.31 15.91,109.61 15.91,109.01 MOTOR_06.MS2 | v33.61,114.11 34.11,114.61 36.11,114.61 | 36.11,114.61 37.91,114.61 39.71,112.81 39.71,112.51 MOTOR_07.MS2 39.81,112.41 39.81,111.11 41.51,109.41 42.31,109.41 43.21,108.51 43.21,106.41 v42.91,106.11 42.91,105.41 41.91,104.41 41.31,104.41 40.31,105.41 v38.21,105.41 | v10.31,44.51 9.01,44.51 MOTOR_02.MS2 | v31.01,40.41 31.81,40.41 32.21,40.01 MOTOR_03.MS2 | v31.01,65.61 31.21,65.81 32.31,65.81 MOTOR_04.MS2 | v27.31,69.11 25.71,69.11 v24.01,67.41 | v50.81,40.61 52.31,40.61 56.01,44.31 56.01,44.51 MOTOR_01.MS2 55.61,43.81 57.01,42.41 66.81,42.41 67.81,43.41 67.81,101.11 69.61,102.91 69.61,109.11 67.81,110.91 65.81,112.91 57.41,112.91 57.11,112.61 v56.31,112.61 | MOTOR_05.MS2 61.81,108.91 61.81,105.21 60.06,103.46 60.01,103.51 57.41,106.11 v57.41,106.41 | v36.11,114.41 36.11,114.61
MSTEP_01  (via drill 0.35)
  Top 0.2: v27.91,106.11 27.91,107.51 U$3.5 | v38.41,85.31 47.31,76.41 v47.31,73.41 | v47.01,65.81 47.01,62.91 49.81,60.11 49.81,53.41 53.41,49.81 58.61,49.81 v62.71,53.91
  Bottom 0.2: v27.91,106.11 27.91,104.31 31.31,100.91 31.31,92.91 38.41,85.81 v38.41,85.31 | v47.31,73.41 47.31,70.91 47.01,70.61 v47.01,65.81 | v62.71,53.91 62.71,48.31 66.21,44.81 66.21,44.61 MOTOR_01.STEP
MSTEP_02  (via drill 0.35)
  Top 0.2: v24.61,99.21 27.81,102.41 U$3.7
  Bottom 0.2: v24.61,99.21 24.61,92.61 3.01,71.01 3.01,42.61 3.61,42.01 16.81,42.01 19.01,44.21 19.01,44.51 MOTOR_02.STEP
MSTEP_03  (via drill 0.35)
  Top 0.2: v25.41,95.01 27.81,97.41 U$3.9 | v25.41,59.41 v25.41,71.41 | v29.01,49.61 30.41,49.61 33.61,46.41 33.61,45.41 36.51,42.51 v38.11,42.51
  Bottom 0.2: v25.41,71.41 v25.41,95.01 | v25.41,59.41 25.41,59.01 29.01,55.41 v29.01,49.61 | v38.11,42.51 40.11,42.51 41.31,43.71 41.91,43.71 42.41,43.21 42.41,40.01 MOTOR_03.STEP
MSTEP_04  (via drill 0.35)
  Top 0.2: v35.51,80.31 29.91,85.91 29.91,90.11 27.91,92.11 27.91,92.31 U$3.11 | v46.61,74.11 v40.41,80.31
  Bottom 0.2: v40.41,80.31 v35.51,80.31 | v46.61,74.11 46.61,70.51 42.61,66.51 42.61,65.91 MOTOR_04.STEP
MSTEP_05  (via drill 0.35)
  Top 0.2: v46.41,92.71 46.11,92.41 44.41,92.41 U$3.14/A0 | v46.41,94.11 46.41,96.51 52.61,102.71 v52.61,104.31
  Bottom 0.2: v46.41,94.11 v46.41,92.71 | v52.61,104.31 52.61,108.01 51.71,108.91 MOTOR_05.STEP
MSTEP_06  (via drill 0.35)
  Top 0.2: v39.41,109.01 40.81,107.61 44.31,107.61 U$3.20/A6 | v4.51,110.21 6.91,110.21 7.11,110.01 11.61,110.01 v11.91,109.71 | v13.01,112.01 19.91,112.01 20.31,112.41 v24.31,112.41
  Bottom 0.2: v39.41,109.01 34.71,109.01 33.71,110.01 26.71,110.01 v24.31,112.41 | 5.71,109.01 MOTOR_06.STEP 5.71,109.11 5.71,110.11 5.61,110.21 v4.51,110.21 | v11.91,109.71 11.91,110.91 v13.01,112.01
MSTEP_07  (via drill 0.35)
  Top 0.2: v38.41,110.91 40.11,112.61 44.31,112.61 U$3.22/A8
  Bottom 0.2: v38.41,110.91 37.91,110.41 31.51,110.41 29.71,112.21 29.71,112.41 MOTOR_07.STEP
MSTEP_08  (via drill 0.35)
  Top 0.2: v40.31,91.01 40.31,92.01 38.71,93.61 U$3.26
  Bottom 0.2: v40.31,91.01 40.31,89.81 43.01,87.11 43.01,86.31 41.11,84.41 41.11,80.01 40.71,79.61 35.21,79.61 33.01,81.81 33.01,84.71 32.71,85.01 31.61,85.01 29.71,83.11 29.71,82.91 MOTOR_08.STEP
N$1
  Top 0.2: R7.2 53.01,71.41 53.01,76.81 55.41,79.21 57.21,79.21 58.21,80.21 58.21,81.11 59.81,82.71 J2.2
N$2
  Top 0.2: C9.1 6.41,66.71 6.41,63.71 6.81,63.31 7.61,63.31 U$2.VCAPH
N$4
  Top 0.2: U$2.GDRIVE 7.61,62.71 4.61,62.71 4.11,63.21 3.31,63.21 U$2.GPD 3.21,63.31 2.41,63.31 2.21,63.51 2.21,69.41 5.31,72.51 U$4.1
N$5
  Top 0.2: C9.2 4.61,66.71 4.61,65.31 3.31,64.01 U$2.VCAPL
N$6
  Top 0.2: R9.1 54.71,69.11 54.71,69.91 56.21,71.41 56.21,72.51 57.51,73.81 57.61,73.81 58.71,74.91 58.71,77.01 58.61,77.11 58.61,80.71 59.41,81.51 60.41,81.51 61.21,82.31 61.21,83.21 60.41,84.01 56.81,84.01 56.51,83.71 U$1.RS
N$9
  Top 0.2: C7.2 12.21,65.21 14.91,65.21 C8.1
N$12
  Top 0.2: D1.A 15.81,86.31 21.51,86.31 D2.A
N$13
  Top 0.2: 49.61,75.92 C5.1 | 54.65,71.31 R7.1 54.61,71.31 53.81,70.51 51.31,70.51 49.91,69.11 49.71,69.11 R8.2 49.43,69.04 49.05,69.22 49.01,69.31 48.31,70.01 48.31,80.91 50.41,83.01 52.01,83.01 53.11,81.91 53.11,80.31 49.61,76.81 49.61,76.01 C5.1 | 49.71,75.82 C5.1
N$14  (via drill 0.35)
  Top 0.2: v53.61,67.91 52.91,67.21 52.31,67.21 51.41,68.11 51.41,69.01 R8.1
  Bottom 0.2: v53.61,67.91 58.71,73.01 58.71,77.01 58.61,77.11 58.61,79.01 59.81,80.21 J1.1
N$193
  Top 0.2: R10.1 67.61,55.61 67.61,58.41 68.31,59.11 STATUS_LED.1
NEOPIXEL_01
  Top 0.2: U$3.16/A2 44.41,97.51 45.31,97.51 50.91,103.11 50.91,104.61 51.31,105.01 59.61,105.01 65.41,110.81 65.41,117.71 66.21,118.51 69.51,118.51 70.01,119.01 70.01,120.41 69.91,120.51 65.11,120.51 64.01,121.61 61.91,121.61 NOE_PIXELS.1
NEOPIXEL_02  (via drill 0.35)
  Top 0.2: v46.81,100.01 44.41,100.01 U$3.17/A3 | v46.01,123.91 57.71,123.91 62.31,123.91 64.41,121.81 67.91,121.81 NOE_PIXELS.2 67.96,121.78
  Bottom 0.2: v46.81,100.01 47.21,100.01 48.71,101.51 48.71,105.01 46.31,107.41 46.31,123.61 v46.01,123.91
NEOPIXEL_03  (via drill 0.35)
  Top 0.2: v30.41,117.71 27.91,115.21 U$3.2 | v52.21,116.71 v45.61,116.71 | 61.86,119.78 NOE_PIXELS.3 61.81,119.61 58.81,119.61 56.11,116.91 v56.11,116.71
  Bottom 0.2: v30.41,117.71 44.61,117.71 v45.61,116.71 | v56.11,116.71 v52.21,116.71
NEOPIXEL_04  (via drill 0.35)
  Top 0.2: v25.91,112.01 26.51,112.61 27.81,112.61 U$3.3 | v20.21,115.21 20.61,115.21 24.91,119.51 38.61,119.51 40.21,121.11 47.41,121.11 v47.91,120.61 | v64.11,119.71 68.01,119.71 NOE_PIXELS.4
  Bottom 0.2: v25.91,112.01 25.71,112.01 22.51,115.21 v20.21,115.21 | v47.91,120.61 58.51,120.61 59.41,119.71 v64.11,119.71
NEOPIXEL_05  (via drill 0.35)
  Top 0.2: v35.31,109.71 34.91,110.11 27.91,110.11 U$3.4 | v37.21,109.71 37.21,112.31 35.41,114.11 35.41,115.11 39.41,119.11 v51.71,119.11 | 61.86,117.78 NOE_PIXELS.5 61.81,117.81 v58.01,117.81
  Bottom 0.2: v37.21,109.71 v35.31,109.71 | v58.01,117.81 53.01,117.81 v51.71,119.11
NEOPIXEL_06
  Top 0.2: U$3.24 41.31,93.61 41.31,91.41 42.61,90.11 42.61,89.31 42.91,89.01 58.41,89.01 70.01,100.61 70.01,116.41 68.81,117.61 68.11,117.61 NOE_PIXELS.6
NEOPIXEL_07  (via drill 0.35)
  Top 0.2: v54.61,106.61 51.71,106.61 46.81,101.71 43.51,101.71 41.31,99.51 41.31,98.11 U$3.25 | 61.86,115.78 NOE_PIXELS.7 61.91,115.61 62.61,115.61 64.11,114.11 64.11,113.41 65.01,112.51 65.01,111.01 64.21,110.21 59.31,110.21 57.61,108.51 v55.61,108.51
  Bottom 0.2: v54.61,106.61 55.61,107.61 v55.61,108.51
NEOPIXEL_08
  Top 0.2: U$3.13 58.61,89.81 65.71,96.91 65.81,97.01 65.81,114.11 67.31,115.61 68.01,115.61 NOE_PIXELS.8
REG_5V
  Top 0.35: 7.71,74.71 7.71,82.41 7.91,82.61 U$4.4 | 7.71,74.71 7.71,64.01 U$2.CATHODE | 6.41,57.21 13.41,64.21 15.61,64.21 22.01,70.61 22.01,72.61 C15.+ | 6.41,57.21 4.01,54.81 4.01,52.11 2.91,51.01 2.91,50.11 S1.6 | 7.71,74.71 7.61,74.71 4.71,74.71 1.71,71.71 1.71,61.91 6.31,57.31 6.41,57.21
RX7  (via drill 0.35)
  Top 0.2: JP4_RX7.1 37.28,102.32 37.31,102.41 38.61,103.71 38.61,104.81 38.91,105.11 38.91,105.71 38.51,106.11 37.91,106.11 37.81,106.01 33.11,106.01 v31.91,107.21 | v30.91,106.21 30.91,105.61 31.11,105.41 31.11,104.81 30.51,104.21 20.51,104.21 20.41,104.31 v20.41,104.51 | 4.16,117.49 I2C.5 3.91,117.61 3.21,117.61 2.01,116.41 2.01,113.01 2.51,112.51 6.51,112.51 v7.61,111.41
  Bottom 0.2: v30.91,106.21 v31.91,107.21 | v7.61,111.41 7.61,111.11 7.31,110.81 7.31,107.11 8.01,106.41 9.91,106.41 12.31,104.01 17.11,104.01 17.41,103.71 19.61,103.71 v20.41,104.51
SCL_00  (via drill 0.35)
  Top 0.2: U1.25 36.55,55.87 36.3,55.62 36.3,53.34 R2.1 38.11,51.51 41.11,48.51 48.01,48.51 48.41,48.11 48.41,46.51 49.51,45.41 61.61,45.41 64.31,48.11 64.91,48.11 68.11,44.91 68.11,29.71 v70.01,27.81 | 47.66,121.86 47.51,122.01 31.01,122.01 27.41,125.61 15.31,125.61 10.91,125.61 7.01,121.71 4.01,121.71 I2C.1 | 47.66,121.86 48.61,120.91 48.61,120.31 47.81,119.51 39.21,119.51 35.01,115.31 35.01,113.91 36.01,112.91 36.01,109.91 40.11,105.81 40.51,105.81 41.21,105.11 44.31,105.11 U$3.19/A5 | v47.91,122.11 47.71,121.91 47.66,121.86
  Bottom 0.2: v70.01,27.81 70.01,117.11 66.01,121.11 66.01,137.81 65.81,138.01 62.51,138.01 62.21,137.71 62.21,133.41 57.71,128.91 52.41,128.91 47.91,124.41 v47.91,122.11
SDA_00  (via drill 0.35)
  Top 0.2: U1.24 36.15,56.18 35.9,55.93 35.9,55.58 | 35.9,55.51 35.9,55.58 | 35.9,55.58 35.9,51.71 R4.1 36.01,51.51 36.81,50.71 36.81,49.21 36.61,49.01 31.61,49.01 30.31,50.31 25.01,50.31 v24.11,49.41 | v29.81,109.31 31.21,107.91 37.31,107.91 39.81,105.41 40.31,105.41 43.21,102.51 44.31,102.51 U$3.18/A4 | v9.61,70.31 9.61,75.71 13.51,79.61 v13.51,84.71 | v18.71,104.41 v22.21,100.91 | v22.21,107.91 v20.21,105.91 | 10.21,121.78 I2C.2 10.11,121.71 7.61,121.71 7.21,121.31 6.21,121.31 5.41,120.51 2.11,120.51 1.81,120.21 1.81,119.21 2.51,118.51 5.81,118.51 6.51,117.81 6.51,117.11 6.91,116.71 12.51,116.71 14.31,114.91 15.51,114.91 18.01,112.41 19.71,112.41 20.21,112.91 20.21,113.61 20.21,113.71 v20.31,113.81
  Bottom 0.2: v29.81,109.31 25.81,109.31 24.71,110.41 | v24.11,49.41 23.31,49.41 22.71,50.01 17.31,50.01 17.11,49.81 13.41,49.81 9.61,53.61 v9.61,70.31 | v13.51,84.71 22.21,93.41 v22.21,100.91 | v20.21,105.91 v18.71,104.41 | 24.71,110.41 v22.21,107.91 | v20.31,113.81 21.31,113.81 24.71,110.41
STATUS_PIN  (via drill 0.35)
  Top 0.2: R10.2 65.81,55.51 65.31,55.51 59.21,49.41 53.21,49.41 48.81,53.81 48.81,60.51 42.81,66.51 41.91,66.51 35.81,72.61 35.81,76.91 23.91,88.81 23.91,100.21 v23.61,100.51 | v12.31,114.81 11.41,115.71 10.21,115.71 I2C.8 | v9.61,105.71 v9.61,108.31
  Bottom 0.2: v12.31,114.81 12.31,113.81 9.61,111.11 v9.61,108.31 | v9.61,105.71 10.01,105.71 12.11,103.61 16.91,103.61 17.21,103.31 20.81,103.31 v23.61,100.51
TRQ1  (via drill 0.35)
  Top 0.2: v12.91,44.51 18.31,44.51 21.41,41.41 v31.01,41.41 | v57.21,43.21 49.31,43.21 46.61,40.51 v36.01,40.51 | v57.91,110.41 56.31,110.41 53.21,113.51 38.81,113.51 38.76,113.46 | v38.41,113.11 38.76,113.46 | 31.01,91.41 v31.01,91.21 31.01,91.41 | 31.01,91.41 31.01,93.61 U$3.32 31.01,93.71 30.31,94.41 30.31,97.91 29.81,98.41 v29.81,99.21 | v37.71,115.81 37.71,115.51 38.71,114.51 38.71,113.51 38.76,113.46 | v39.91,71.61 39.91,76.91 31.61,85.21 31.21,85.21 30.31,86.11 30.31,90.71 31.01,91.41
  Bottom 0.2: v12.91,44.51 11.51,44.51 MOTOR_02.1 | 31.56,41.96 31.61,42.01 33.01,42.01 34.81,40.21 34.81,40.01 MOTOR_03.1 34.81,40.31 35.01,40.51 v36.01,40.51 | 31.56,41.96 v31.01,41.41 | 31.56,41.96 31.51,42.01 30.91,42.61 30.91,55.51 26.51,59.91 26.51,67.81 26.71,68.01 33.01,68.01 34.91,66.11 34.91,65.91 MOTOR_04.1 34.71,66.41 v39.91,71.61 | v57.21,43.21 58.51,44.51 MOTOR_01.1 | v57.91,110.41 59.31,109.01 MOTOR_05.1 | v38.41,113.11 37.91,113.11 37.31,112.51 MOTOR_07.1 | v31.01,91.21 31.01,89.31 37.21,83.11 37.21,82.91 MOTOR_08.1 | 17.81,112.01 18.11,112.01 20.01,110.11 20.01,107.11 21.31,105.81 23.21,105.81 v29.81,99.21 | 17.81,112.01 16.11,112.01 13.31,109.21 13.31,109.01 MOTOR_06.1 | v37.71,115.81 20.61,115.81 19.81,116.61 18.21,116.61 17.81,116.21 17.81,112.01
TRQ2  (via drill 0.35)
  Top 0.2: v32.61,85.71 32.61,94.41 31.11,95.91 31.11,98.01 U$3.33 | v14.31,111.21 16.71,111.21 17.31,110.61 24.81,110.61 | 24.81,110.61 26.11,110.61 26.81,111.31 v33.61,111.31 | 24.81,110.61 v24.81,109.31 | v59.71,44.51 57.91,44.51 | 57.91,44.51 50.01,44.51 46.91,41.41 v38.81,41.41 35.11,41.41 29.61,46.91 v25.41,46.91 | 57.91,44.51 57.91,42.91 v54.91,39.91 | v46.11,61.31 45.71,61.31 39.61,67.41 v38.91,67.41 | v49.41,86.81 v42.31,86.81
  Bottom 0.2: 10.81,109.21 10.81,109.01 MOTOR_06.2 10.71,109.01 10.71,110.31 12.31,111.91 12.31,112.31 12.71,112.71 13.31,112.71 14.31,111.71 v14.31,111.21 | v33.61,111.31 34.71,112.41 MOTOR_07.2 | v24.81,109.31 24.81,106.81 30.51,101.11 30.51,94.91 30.31,94.71 30.31,89.41 32.61,87.11 v32.61,85.71 34.71,83.61 34.71,82.91 MOTOR_08.2 34.71,82.81 34.71,82.61 36.61,80.71 37.91,80.71 38.91,81.71 38.91,84.71 41.01,86.81 v42.31,86.81 | v38.81,41.41 37.41,40.01 MOTOR_03.2 | v59.71,44.51 61.11,44.51 MOTOR_01.2 | v25.41,46.91 16.11,46.91 14.11,44.91 14.11,44.61 MOTOR_02.2 | 38.86,67.46 49.11,77.71 49.11,86.81 | 38.86,67.46 37.51,66.11 37.51,65.91 37.53,65.91 MOTOR_04.2 | 49.11,86.81 49.11,98.31 56.71,105.91 56.71,108.91 MOTOR_05.2 | v54.91,39.91 49.51,39.91 46.31,43.11 46.31,55.71 48.21,57.61 48.21,59.21 v46.11,61.31 | v38.91,67.41 38.86,67.46 | 49.11,86.81 v49.41,86.81
TX7  (via drill 0.35)
  Top 0.2: JP3_TX7.1 33.41,101.31 33.41,104.71 29.51,108.61 22.31,108.61 v22.01,108.91 | v19.51,113.21 19.11,112.81 18.21,112.81 15.71,115.31 14.51,115.31 12.21,117.61 10.21,117.61 I2C.6
  Bottom 0.2: v19.51,113.21 22.01,110.71 v22.01,108.91
VCC_5V  (via drill 0.35)
  Top 0.35: S1.2 8.51,52.51 8.51,51.71 9.51,50.71 v9.51,40.91 9.61,40.81 14.81,40.81 20.91,34.71 v42.41,34.71 | v50.61,122.91 44.41,122.91 U$3.VIN 44.31,123.01 v31.71,123.01 | 50.71,122.81 v50.61,122.91 | 3.75,111.7 I2C.11 | I2C.11 4.11,111.61 v6.21,111.61 6.31,111.51 7.31,110.51 13.71,110.51 19.51,104.71 19.51,104.31 20.11,103.71 22.81,103.71 v23.01,103.51 | NOE_PIXELS.11 61.81,111.61 59.01,111.61 54.91,115.71 54.81,115.81 54.81,118.71 50.81,122.71 v50.61,122.91 | v2.11,75.31 1.21,76.21 1.21,110.21 2.61,111.61 3.61,111.61 I2C.11
  Bottom 0.35: 9.51,40.51 v9.51,40.91 | 9.51,40.51 19.01,31.01 19.01,30.61 MOTOR_02.FAULT | 42.51,34.61 42.51,26.01 MOTOR_03.FAULT | 45.91,38.01 42.51,34.61 | 45.91,38.01 45.91,42.81 45.71,43.01 45.71,48.41 42.61,51.51 42.61,51.91 MOTOR_04.FAULT | MOTOR_01.FAULT 66.21,30.61 66.21,30.91 59.21,37.91 46.01,37.91 45.91,38.01 | v42.41,34.71 42.51,34.61 | v50.61,122.91 51.61,122.91 MOTOR_05.FAULT | 5.61,121.61 5.61,122.91 MOTOR_06.FAULT 5.71,121.51 6.91,120.31 | MOTOR_08.FAULT 29.61,96.81 29.61,97.11 23.51,103.21 23.41,103.11 23.31,103.21 v23.01,103.51 | 6.91,120.31 24.81,120.31 29.61,125.11 29.61,126.41 MOTOR_07.FAULT 29.71,125.01 v31.71,123.01 | 9.51,40.51 9.41,40.51 4.41,40.51 2.51,42.41 2.41,42.51 1.21,43.71 1.21,74.41 v2.11,75.31 | v6.21,111.61 6.41,111.81 6.41,119.81 6.81,120.21 6.91,120.31
VCC_M
  Bottom 0.61: 50.2,139.17 MC7.+ 44.88,133.85 MOTOR_07.VM 46.93,124.41 46.93,107.65 50.88,103.69 MC8.+ 50.83,102.77 47.38,99.32 MOTOR_08.VM 46.72,94.95 48.45,94.95 48.45,77.93 47.44,76.92 40.63,76.92 POWER_M.1 33.77,70.06 22.65,70.06 MC4.+ 18.7,64.25 27.33,55.62 MOTOR_04.VM 27.33,46.9 24.83,44.4 24.83,29.67 | 50.2,139.17 50.8,139.77 50.8,139.78 53.35,142.33 63.58,142.33 MC5.+ 68.96,124.95 MOTOR_05.VM | MOTOR_06.VM 20.91,125.83 29.67,134.59 MC6.+ 32.88,136.89 34.81,138.83 38.73,138.83 38.8,138.89 49.92,138.89 50.2,139.17 | MC3.+ 24.83,14.94 24.83,29.67 | MOTOR_03.VM 24.83,28.33 24.83,29.67 | MC3.+ 19.49,9.61 7.05,9.61 2.62,14.04 MC2.+ 2.62,29.35 MOTOR_02.VM | MC3.+ 27.53,11.38 42.1,11.38 42.94,12.22 MC1.+ 42.94,16.03 50.97,24.06 MOTOR_01.VM
VCC_MCU
  Top 0.2: U$2.ANODE 3.78,61.42 8.44,61.42 8.64,61.62 8.64,63.36 C7.1 10.45,68.52 U$4.3 13.38,75.48 13.38,77.1 15.78,79.51 15.78,79.71 D1.C 15.81,82.01 17.91,84.11 22.31,84.11 29.91,76.51 29.91,74.41 POWER_MCU.1

## Text on the board
tPlace: 7 | 6 | 5 | I2C | LED | GND | 5V | SCL | 3.3V | 5V | GND | 5V | GND | 8 | MMS2 | MMS1 | CAN BUS | INPUT | HIGH | GND | 5V | GND | GND | GND | LOW | HIGH | MCU | MOTOR | LOW | ADDR1 | OUTPUT | GND | OFF | ADDR | ADDR0 | ON | 4 | 2 | 1 | 3 | 3.3V | RoboScope v1.0 | MIT Media Lab | Thomas Sanchez Lengeling
bPlace: 7 | 6 | 5 | 8 | MCU | MOTOR | GND | GND | 4 | 2 | 1 | 3